# EAGLE design tps62180_v0001 (EAGLE 6.4)
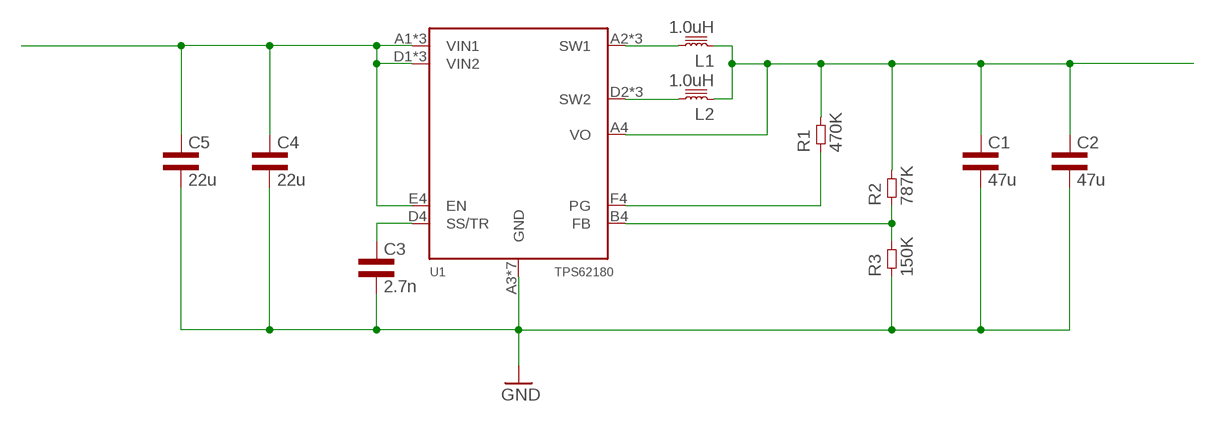
[diagram p0: schematic, sheet 1]

## Parts
C1  47u  CAP1206L3  [1206L3]
C2  47u  CAP1206L3  [1206L3]
C3  2.7n  CAP0402L3  [0402L3]
C4  22u  CAP1206L3  [1206L3]
C5  22u  CAP1206L3  [1206L3]
L1  1.0uH  INDUCTORSPM3012  [SPM3012]
L2  1.0uH  INDUCTORSPM3012  [SPM3012]
R1  470K  RES0603L3  [0603L3]
R2  787K  RES0603L3  [0603L3]
R3  150K  RES0603L3  [0603L3]
U1  TPS62180  [R-XBGA-N24]

## Nets
FB: R2.P$1 R3.P$2 U1.B4(FB)
GND: C1.2 C2.2 C3.P$2 C4.2 C5.2 R3.P$1 U1.A3(GND) U1.B3(GND) U1.C3(GND) U1.C4(GND) U1.D3(GND) U1.E3(GND) U1.F3(GND)
PG: R1.P$1 U1.F4(PG)
SS: C3.P$1 U1.D4(SS/TR)
SW1: L1.2 U1.A2(SW1) U1.B2(SW1) U1.C2(SW1)
SW2: L2.2 U1.D2(SW2) U1.E2(SW2) U1.F2(SW2)
VIN: C4.1 C5.1 U1.A1(VIN1) U1.B1(VIN1) U1.C1(VIN1) U1.D1(VIN2) U1.E1(VIN2) U1.E4(EN) U1.F1(VIN2)
VOUT: C1.1 C2.1 L1.1 L2.1 R1.P$2 R2.P$2 U1.A4(VO)

## Library data of the parts
C1-C5 = common:CAP
L1 L2 = common:INDUCTOR
R1-R3 = common:RES
U1 = common:TPS62180

## Board
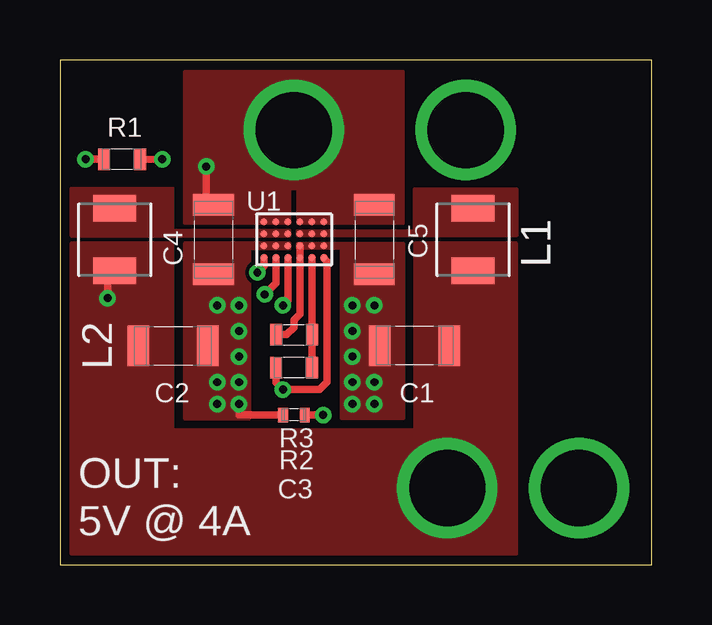
[diagram p1: board, top side]
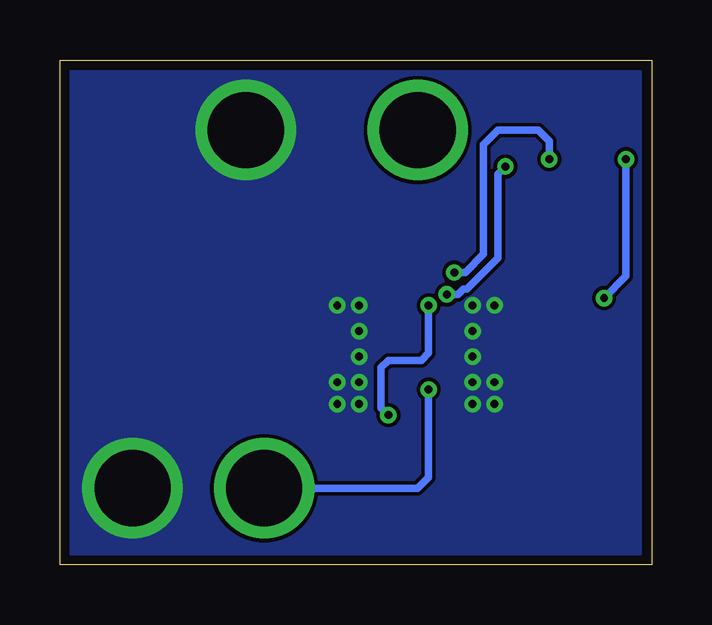
[diagram p2: board, bottom side, seen from below]

Size 24.67 x 21.06 mm. Coordinates in mm from the lower left corner, seen from the top.
Outline: 0,0 24.67,0 24.67,21.06 0,21.06 0,0
Copper layers (1*16): Top 0.035mm / dielectric 1.5mm / Bottom 0.035mm
Design rules "osh_2_layer *": minimum track width 6mil, minimum drill 13mil, track to track 6mil, track to pad 6mil, pad to pad 6mil, via to via 6mil, smd to smd 6mil, copper to edge 15mil, drill to drill 8mil, minimum pad ring 7mil, minimum via ring 7mil, stop-mask expansion 4mil, vias tented up to drill 16mil, thermal gap 10mil

### Footprints (pad centres in the part's own frame; a part is rotated, then mirrored left to right if it is on the bottom)
1206L3 = smd 0.9 x 1.7: 1 -1.45,0; 2 1.45,0
0402L3 = smd 0.4 x 0.6: P$1 -0.45,0; P$2 0.45,0
SPM3012 = smd 1.1 x 1.8: 1 -1.3,0; 2 1.3,0
0603L3 = smd 0.5 x 0.9: P$1 -0.75,0; P$2 0.75,0
R-XBGA-N24 = smd 0.29 x 0.29: A1 -0.75,1.25; A2 -0.25,1.25; A3 0.25,1.25; A4 0.75,1.25; B1 -0.75,0.75; B2 -0.25,0.75; B3 0.25,0.75; B4 0.75,0.75; C1 -0.75,0.25; C2 -0.25,0.25; C3 0.25,0.25; C4 0.75,0.25; D1 -0.75,-0.25; D2 -0.25,-0.25; D3 0.25,-0.25; D4 0.75,-0.25; E1 -0.75,-0.75; E2 -0.25,-0.75; E3 0.25,-0.75; E4 0.75,-0.75; F1 -0.75,-1.25; F2 -0.25,-1.25; F3 0.25,-1.25; F4 0.75,-1.25

### Placement (x,y rotation side)
C1  14.78,9.14 180 top
C2  4.72,9.14 0 top
C3  9.75,6.25 180 top
C4  6.4,13.56 270 top
C5  13.11,13.56 270 top
L1  17.22,13.56 90 top
L2  2.29,13.56 90 top
R1  2.59,16.92 180 top
R2  9.75,8.23 180 top
R3  9.75,9.6 0 top
U1  9.75,13.56 270 top

### Tracks (layer width: path | path; a pad name or v marks a point on that pad's centre or on a via)
FB
  Top 0.305: U1.B4 10.5,12.51 10.52,12.34 10.52,9.61 R3.P$2 R2.P$1
GND  (via drill 0.33, 3.17 pad 3.81)
  Top 0.305: U1.C3 U1.C4 10,10.46 9.75,10.21 9.75,9.91 9.45,9.6 R3.P$1 | C3.P$2 7.47,6.25 v7.47,6.71
  other vias: 13.11,10.82 16.92,18.14 12.19,10.82 12.19,9.75 12.19,8.69 12.19,7.62 12.19,6.71 13.11,6.71 13.11,7.62 7.47,10.82 6.55,10.82 6.55,7.62 6.55,6.71 7.47,9.75 7.47,8.69 7.47,7.62 21.64,3.2
  pour Bottom: 0.46,20.57 24.23,20.57 24.23,0.46 0.46,0.46
  pour Top (no thermals): 9.91,13.41 14.33,13.41 14.33,6.1 11.73,6.1 11.73,13.18 9.91,13.18
  pour Top (no thermals): 9.6,13.41 5.18,13.41 5.18,6.1 7.92,6.1 7.92,13.18 9.6,13.18
PG  (via drill 0.33)
  Top 0.305: U1.F4 8.5,12.47 v8.23,12.19 | v4.27,16.92 R1.P$1
  Bottom 0.305: v8.23,12.19 7.77,12.19 7.01,12.95 7.01,17.53 6.4,18.14 4.72,18.14 4.27,17.68 v4.27,16.92
SS  (via drill 0.33)
  Top 0.305: U1.D4 9.5,11.03 v9.3,10.82 | v10.97,6.25 C3.P$1
  Bottom 0.305: v9.3,10.82 9.3,8.84 9.6,8.53 10.97,8.53 11.28,8.23 11.28,6.55 v10.97,6.25
SW1
  pour Top (no thermals): 9.91,13.94 14.78,13.94 14.78,15.7 19.05,15.7 19.05,13.72 9.91,13.72
SW2
  pour Top (no thermals): 9.6,13.94 4.72,13.94 4.72,15.7 0.46,15.7 0.46,13.72 9.6,13.72
VIN  (via drill 0.33, 3.17 pad 3.81)
  Top 0.305: U1.E4 9,11.75 v8.53,11.28 | v6.1,16.61 6.1,15.32 C4.1
  Bottom 0.305: v8.53,11.28 8.08,11.28 7.85,11.51 7.7,11.51 6.4,12.8 6.4,16.31 v6.1,16.61
  other vias: 9.75,18.14
  pour Top (no thermals): 9.6,14.25 9.6,15.7 9.91,15.7 9.91,14.25 14.33,14.25 14.33,20.57 5.18,20.57 5.18,14.25
VOUT  (via drill 0.33, 3.17 pad 3.81)
  Top 0.305: U1.A4 11,12.77 11.13,12.65 11.13,7.62 10.82,7.31 v9.3,7.31 9,7.61 R2.P$2 | R1.P$2 1.54,16.93 v1.07,16.92 | v1.98,11.12 1.98,11.96 L2.1
  Bottom 0.305: v9.3,7.31 9.3,3.66 9.75,3.2 v16.15,3.2 | v1.07,16.92 1.07,12.04 v1.98,11.12
  pour Top (no thermals): 4.72,13.41 0.46,13.41 0.46,0.46 19.05,0.46 19.05,13.41 14.78,13.41 14.78,5.64 4.72,5.64

### Text on the board
tPlace: OUT: | 5V @ 4A